# EAGLE design WiFiShield (EAGLE 6.5.0)
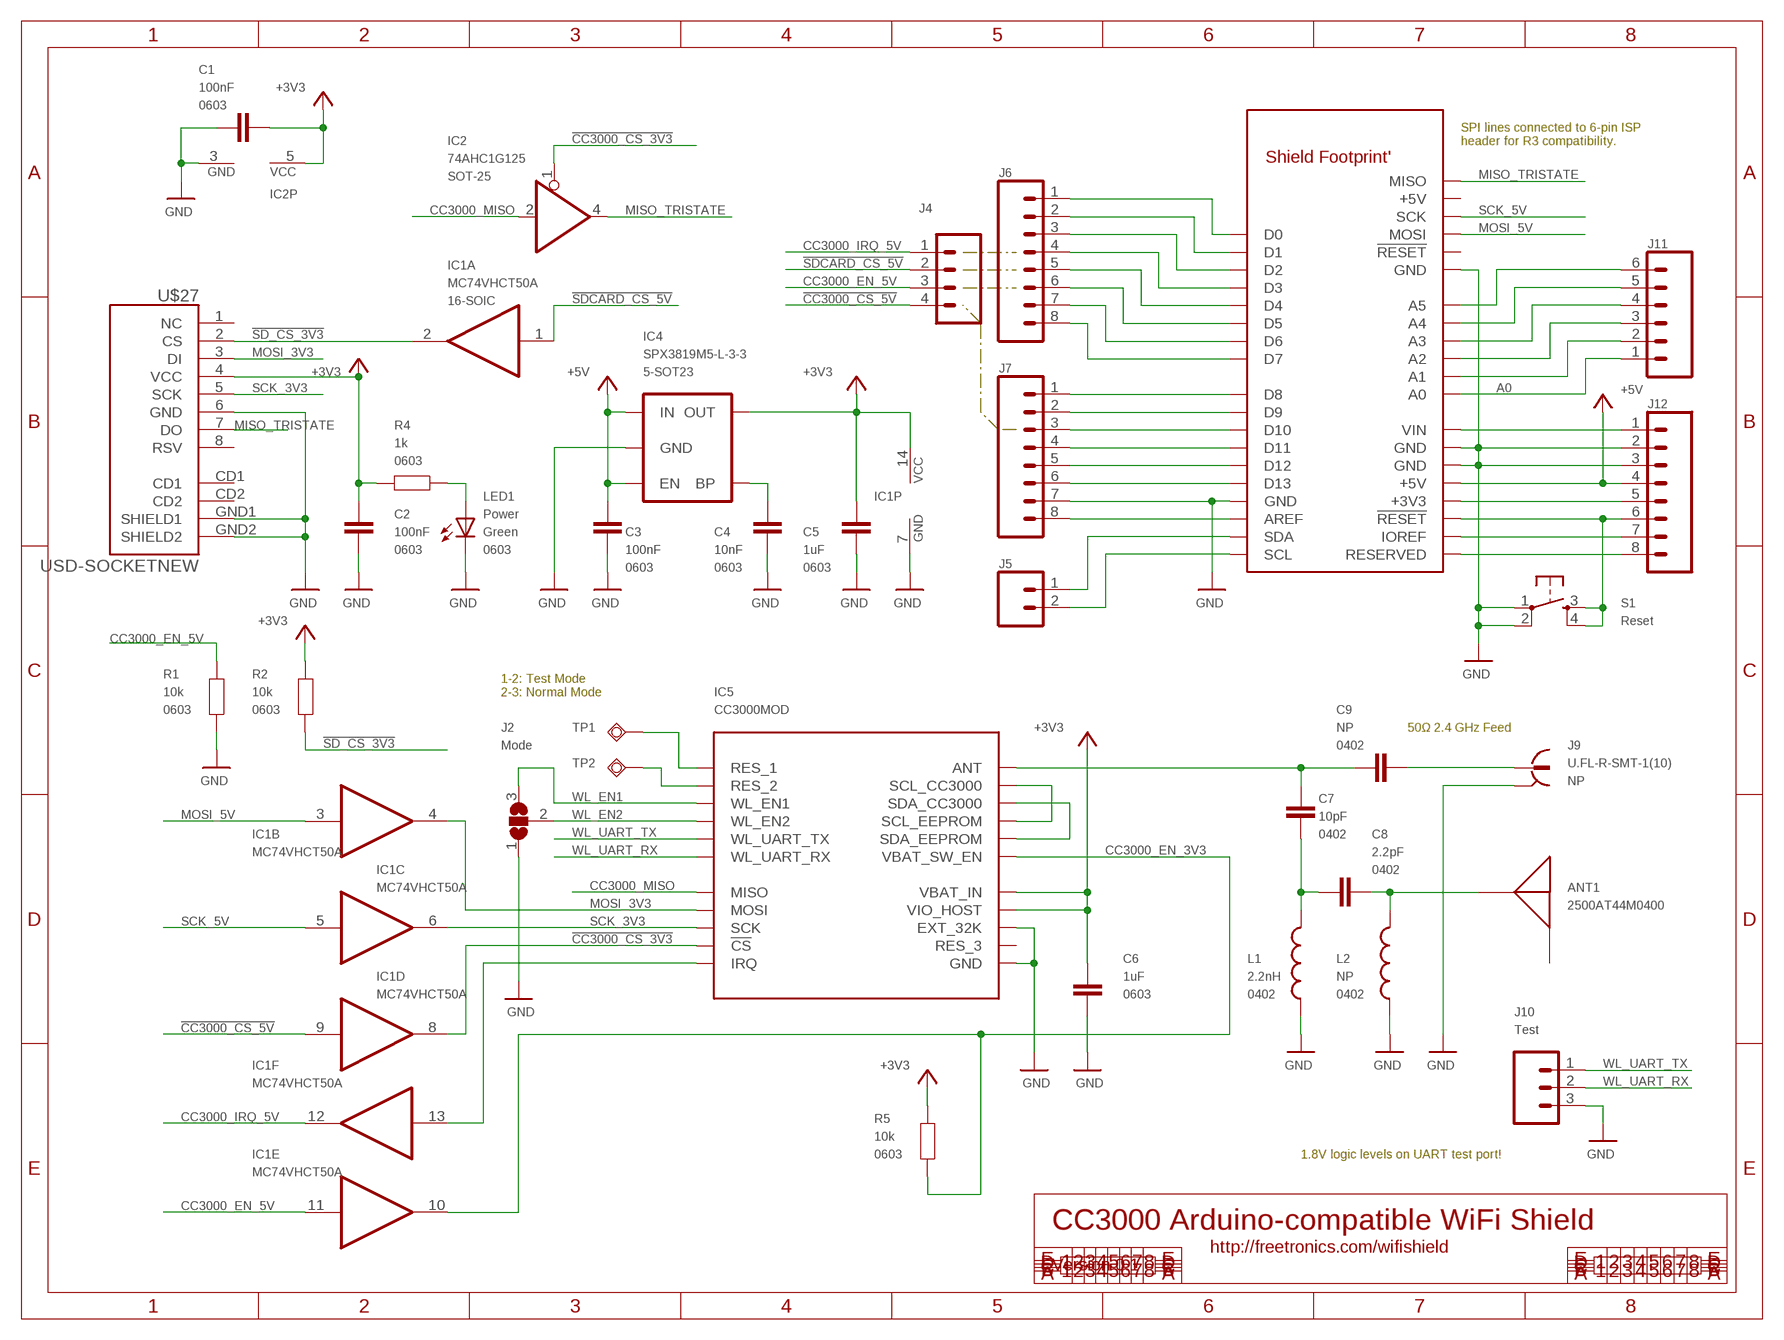
[diagram p0: schematic, sheet 1]

## Parts
ANT1  2500AT44M0400  [2500AT44M0400]
C1  100nF  CAP0603  [0603]
C2  100nF  CAP0603  [0603]
C3  100nF  CAP0603  [0603]
C4  10nF  CAP0603  [0603]
C5  1uF  CAP0603  [0603]
C6  1uF  CAP0603  [0603]
C7  10pF  CAP0402  [C0402]
C8  2.2pF  CAP0402  [C0402]
C9  NP  CAP0402  [C0402]
IC1  MC74VHCT50A  [SO14]
IC2  74AHC1G125  74AHC1G125DBV  [SOT23-5]
IC4  SPX3819M5-L-3-3  V_REG_LDOSMD  [SOT23-5]
IC5  CC3000MOD  CC3000  [CC3000]
J2  Mode  SJ2W  [SJ_2]
J4  M04PTH  [1X04]
J5  M02PTH  [1X02]
J6  M08STD  [1X08]
J7  M08STD  [1X08]
J8  ARDUINO-SHIELD_R3  [ARDUINO-SHIELD_R3_NOHOLES]
J9  U.FL-R-SMT-1(10)  UFL  [UFL]
J10  Test  M03PTH  [1X03]
J11  M06SIP  [1X06]
J12  M08STD  [1X08]
L1  2.2nH  INDUCTOR0402  [C0402]
L2  NP  INDUCTOR0402  [C0402]
LED1  Power  LED0603  [LED-0603]
R1  10k  RESISTOR0603  [0603]
R2  10k  RESISTOR0603  [0603]
R4  1k  RESISTOR0603  [0603]
R5  10k  RESISTOR0603  [0603]
S1  Reset  TAC_SWITCHSMD  [TACTILE_SWITCH_SMD]
TP1  R1  TPSQTP06R  [TP06R]
TP2  R2  TPSQTP06R  [TP06R]
U$27  USD-SOCKETNEW  [MICRO-SD-SOCKET-PP]

## Nets
!CC3000_CS_3V3: IC1.8(D:O) IC2.1(OE) IC5.12(!CS)
!CC3000_CS_5V: IC1.9(D:I) J4.4
!SD_CS_3V3: IC1.2(A:O) R2.2 U$27.2(CS)
!SDCARD_CS_5V: IC1.1(A:I) J4.2
+3V3: C1.2 C2.1 C5.1 C6.2 IC1.14(P:VCC) IC2.5(VCC) IC4.5(OUT) IC5.19(VBAT_IN) IC5.23(VIO_HOST) R2.1 R4.2 R5.1 U$27.4(VCC)
+5V: C3.2 IC4.1(IN) IC4.3(EN) J8.+5V J12.4
A0: J8.A0 J11.1
CC3000_EN_3V3: IC1.10(E:O) IC5.26(VBAT_SW_EN) R5.2
CC3000_EN_5V: IC1.11(E:I) J4.3 R1.1
CC3000_IRQ_5V: IC1.12(F:O) J4.1
CC3000_MISO: IC2.2(I) IC5.13(MISO)
GND: C1.1 C2.2 C3.1 C4.1 C5.2 C6.1 IC1.7(P:GND) IC2.3(GND) IC4.2(GND) IC5.1(GND) IC5.9(GND) IC5.10(GND) IC5.11(GND) IC5.16(GND) IC5.18(GND) IC5.20(GND) IC5.21(EXT_32K) IC5.22(GND) IC5.25(GND) IC5.31(GND) IC5.32(GND) IC5.33(GND) IC5.34(GND) IC5.36(GND) IC5.37(GND) IC5.38(GND) IC5.39(GND) IC5.40(GND) IC5.41(GND) IC5.42(GND) IC5.43(GND) IC5.44(GND) IC5.45(GND) IC5.46(GND) J2.1 J7.7 J8.GND J8.GND@0(GND) J8.GND@1(GND) J8.GND@2(GND) J9.GND J9.GND@1(GND) J10.3 J12.2 J12.3 L1.2 L2.2 LED1.C R1.2 S1.1 S1.2 U$27.6(GND) U$27.GND1(SHIELD1) U$27.GND2(SHIELD2)
IOREF: J8.IOREF J12.7
MISO_TRISTATE: IC2.4(O) J8.MISO U$27.7(DO)
MOSI_3V3: IC1.4(B:O) IC5.15(MOSI) U$27.3(DI)
MOSI_5V: IC1.3(B:I) J8.MOSI
N$1: IC5.27(SDA_EEPROM) IC5.28(SDA_CC3000)
N$2: IC5.29(SCL_EEPROM) IC5.30(SCL_CC3000)
N$4: LED1.A R4.1
N$16: C7.2 C9.2 IC5.35(ANT)
N$28: IC5.4(RES_2) TP2.TP
N$29: IC5.2(RES_1) TP1.TP
N$30: C9.1 J9.SIG
N$42: IC1.13(F:I) IC5.14(IRQ)
N$43: C4.2 IC4.4(BP)
N$48: J8.A1 J11.2
N$49: J8.A2 J11.3
N$50: J8.A3 J11.4
N$72: J8.A4 J11.5
N$73: J8.A5 J11.6
N$74: J8.RESERVED J12.8
N$75: J8.VIN J12.1
N$77: J8.3V3(+3V3) J12.5
N$78: J8.!RESET J12.6 S1.3 S1.4
N$82: J6.1 J8.D0
N$87: J6.2 J8.D1
N$88: J6.3 J8.D2
N$89: J6.4 J8.D3
N$90: J6.5 J8.D4
N$103: C7.1 C8.2 L1.1
N$104: ANT1.P$1 C8.1 L2.1
N$123: J6.6 J8.D5
N$124: J6.7 J8.D6
N$125: J6.8 J8.D7
N$126: J5.1 J8.SDA
N$127: J7.8 J8.AREF
N$128: J7.6 J8.D13
N$129: J7.5 J8.D12
N$130: J5.2 J8.SCL
N$131: J7.1 J8.D8
N$132: J7.2 J8.D9
N$133: J7.3 J8.D10
N$134: J7.4 J8.D11
SCK_3V3: IC1.6(C:O) IC5.17(SCK) U$27.5(SCK)
SCK_5V: IC1.5(C:I) J8.SCK
WL_EN1: IC5.7(WL_EN1) J2.3
WL_EN2: IC5.5(WL_EN2) J2.2
WL_UART_RX: IC5.8(WL_UART_RX) J10.2
WL_UART_TX: IC5.6(WL_UART_TX) J10.1
Unconnected: ANT1.P$2 IC5.24(RES_3) J8.!RESET@0(!RESET) J8.+5V@0(+5V) U$27.1(NC) U$27.8(RSV) U$27.CD1 U$27.CD2

## Notes on the sheet
- SPI lines connected to 6-pin ISP
  header for R3 compatibility.
- 1-2: Test Mode
  2-3: Normal Mode
- 50Ω 2.4 GHz Feed
- 1.8V logic levels on UART test port!
- CC3000 Arduino-compatible WiFi Shield
- http://freetronics.com/wifishield
- Version 0.1

## Library data of the parts
ANT1 = freetronics-angus:2500AT44M0400
C1-C6 = freetronics-master-v1:CAP: Capacitor Standard 0603 ceramic capacitor, and 0.1" leaded capacitor.; PACKAGE: 0603
C7-C9 = freetronics-master-v1:CAP: Capacitor Standard 0603 ceramic capacitor, and 0.1" leaded capacitor.; PACKAGE: 0402
IC1 = freetronics-angus:MC74VHCT50A: Hex non-inverting BUFFER; PACKAGE: 16-SOIC
IC2 = 74xx-little-de:74*1G125: Single Bus Buffer Gate with 3-State Output; PACKAGE: SOT-25
IC4 = SparkFun:V_REG_LDO: Voltage Regulator LDO Standard 150mA LDO voltage regulator in SOT-23 layout. Micrel part MIC5205. BP (by-pass) pin is used to lower output noise with 470pF cap.; PACKAGE: 5-SOT23
IC5 = freetronics-luke:CC3000: Texas Instruments CC3000 802.11b/g Network Processor
J2 = freetronics-master-v1:SJ2W: SMD solder JUMPER
J4 = freetronics-master-v1.1:M04: Header 4 Standard 4-pin 0.1" header. Use with straight break away headers (SKU : PRT-00116), right angle break away headers (PRT-00553), swiss pins (PRT-00743), machine pins (PRT-00117), and female headers (PRT-00115). Molex polarized connector foot print use with SKU : PRT-08231 with associated crimp pins and housings.
J5 = freetronics-master-v1:M02: Header 2 Standard 2-pin 0.1" header. Use with straight break away headers (SKU : PRT-00116), right angle break away headers (PRT-00553), swiss pins (PRT-00743), machine pins (PRT-00117), and female headers (PRT-00115). Molex polarized connector foot print use with SKU : PRT-08233 with associated crimp pins and housings.
J6 J7 J12 = freetronics-master-v1:M08: Header 8 Standard 8-pin 0.1" header. Use with straight break away headers (SKU : PRT-00116), right angle break away headers (PRT-00553), swiss pins (PRT-00743), machine pins (PRT-00117), and female headers (PRT-00115).
J8 = freetronics-angus:ARDUINO-SHIELD_R3: Arduino Uno/Eleven/Leonardo shield, R3 compatible.
J9 = freetronics-luke:UFL: U.FL RF connector; NOTE: NP
J10 = freetronics-master-v1:M03: Header 3 Standard 3-pin 0.1" header. Use with straight break away headers (SKU : PRT-00116), right angle break away headers (PRT-00553), swiss pins (PRT-00743), machine pins (PRT-00117), and female headers (PRT-00115). Molex polarized connector foot print use with SKU : PRT-08232 with associated crimp pins and housings.
J11 = freetronics-master-v1:M06: Header 6 Standard 6-pin 0.1" header. Use with straight break away headers (SKU : PRT-00116), right angle break away headers (PRT-00553), swiss pins (PRT-00743), machine pins (PRT-00117), and female headers (PRT-00115). Molex polarized connector foot print use with SKU : PRT-08094 with associated crimp pins and housings. NOTES ON THE VARIANTS LOCK and LOCK_LONGPADS... This footprint was designed to help hold the alignment of a through-hole component (i.e. 6-pin header) while soldering it into place. You may notice that each hole has been shifted either up or down by 0.005 of an inch from it's more standard position (which is a perfectly straight line). This slight alteration caused the pins (the squares in the middle) to touch the edges of the holes. Because they are alternating, it causes a "brace" to hold the component in place. 0.005 has proven to be the perfect amount of "off-center" position when using our standard breakaway headers. Although looks a little odd when you look at the bare footprint, once you have a header in there, the alteration is very hard to notice. Also, if you push a header all the way into place, it is covered up entirely on the bottom side. This idea of altering the position of holes to aid alignment will be further integrated into the Sparkfun Library for other footprints. It can help hold any component with 3 or more connection pins.
L1 L2 = freetronics-master-v1:INDUCTOR: Inductors Basic Inductor/Choke - 0603 and 1206. Footprints are not proven and vary greatly between part numbers.; PACKAGE: 0402
LED1 = freetronics-master-v1:LED: LEDs Standard schematic elements and footprints for 5mm, 3mm, 1206, and 0603 sized LEDs. 5mm - Spark Fun Electronics SKU : COM-00529 (and others); COLOUR: Green; PACKAGE: 0603
R1 R2 R4 R5 = freetronics-master-v1:RESISTOR: Resistor Basic schematic elements and footprints for 0603, 1206, and PTH 1/10th watt (small) resistors.; PACKAGE: 0603
S1 = freetronics:TAC_SWITCH: Momentary Switch Button commonly used for reset or general input. Spark Fun Electronics SKU : COM-00097
TP1 TP2 = testpad:TPSQ: Test pad
U$27 = freetronics-master-v1.1:USD-SOCKET: microSD Socket Push-push type uSD socket. Schematic element and footprint production proven. Spark Fun Electronics SKU : PRT-00127. tDoc lines correctly indicate media card edge positions when inserting (unlocked, locked, depressed).

## Net classes
1 POWER: width 0.305 mm

## Board
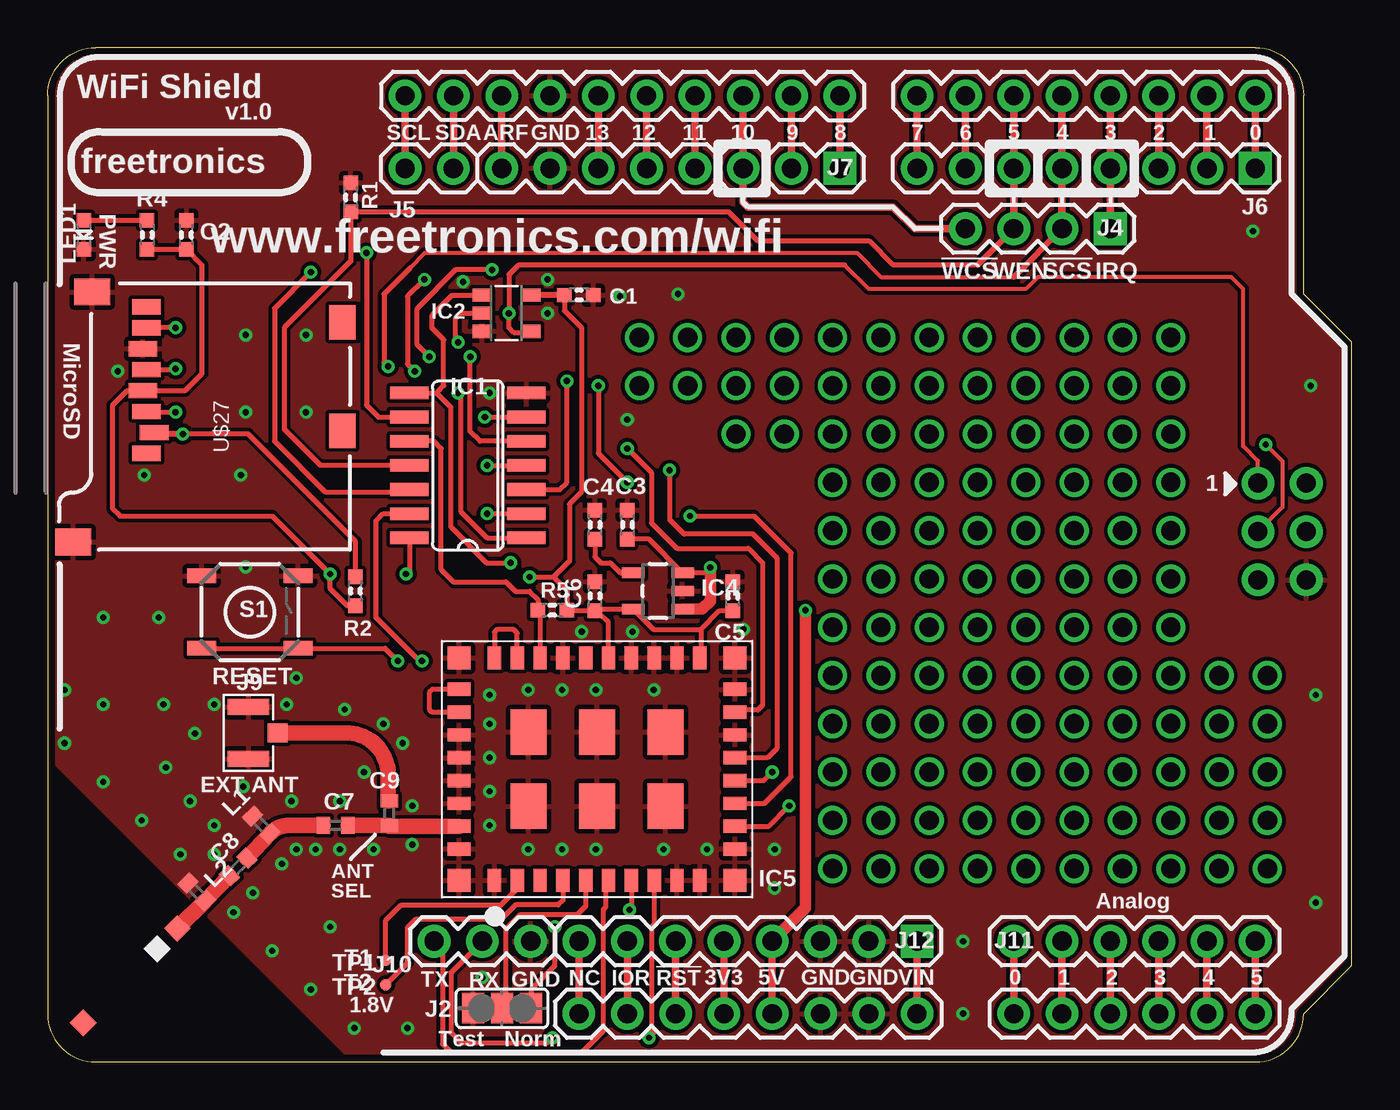
[diagram p1: board, top side]
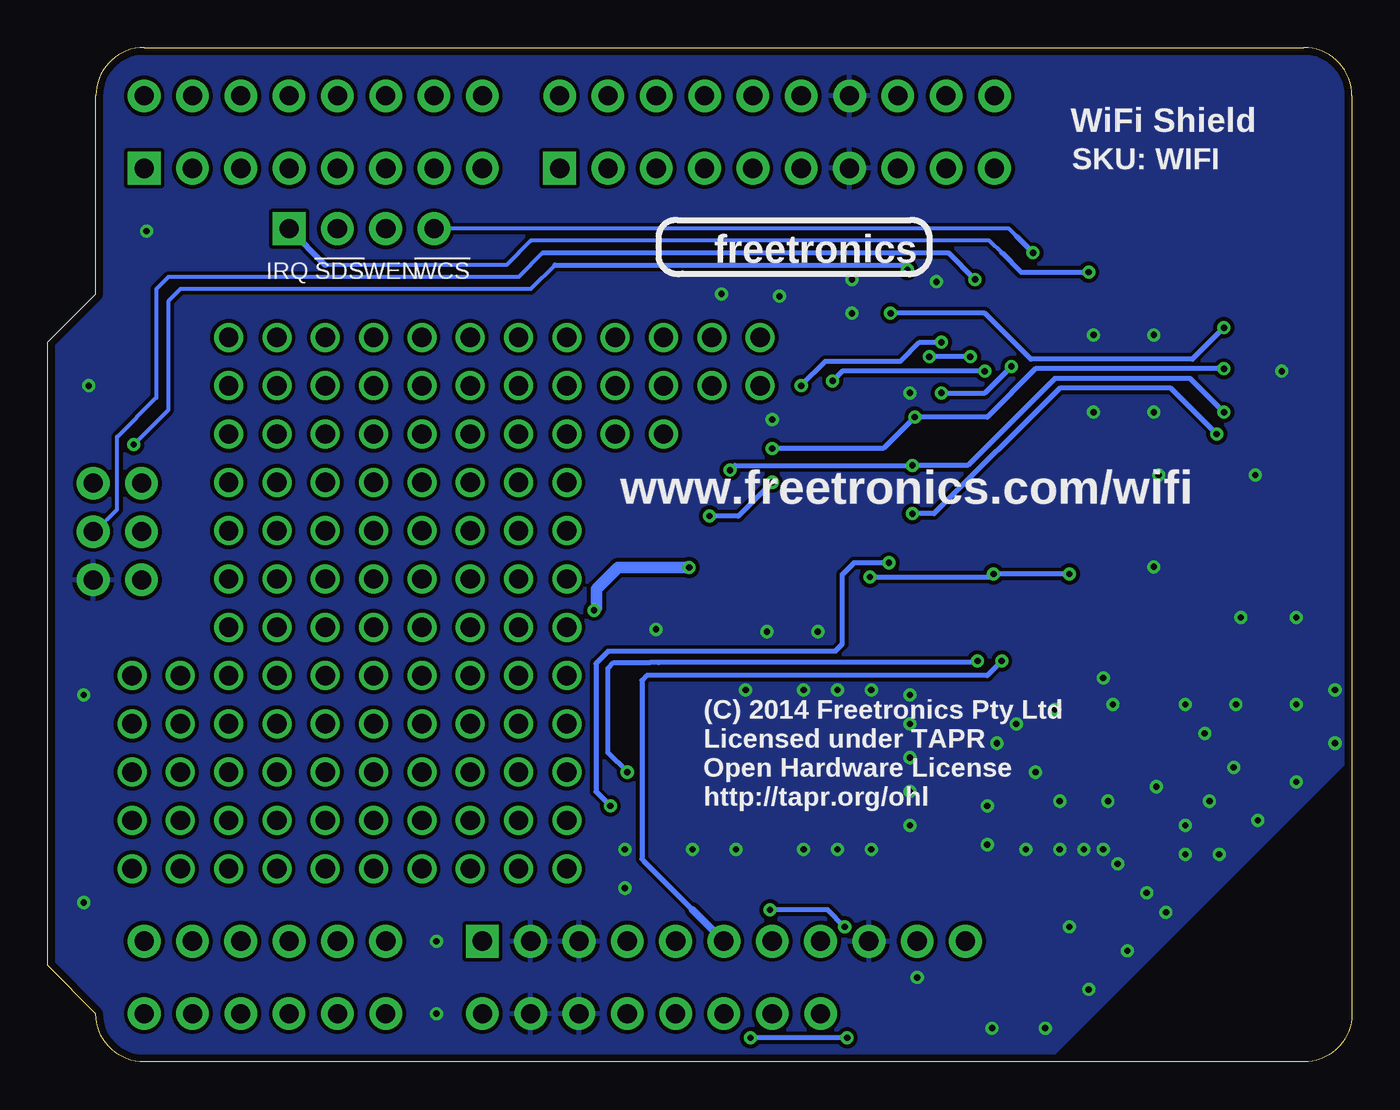
[diagram p2: board, bottom side, seen from below]

Size 68.58 x 53.34 mm. Coordinates in mm from the lower left corner, seen from the top.
Copper layers (1*16): Top 0.0356mm / dielectric 1.5011mm / Bottom 0.0356mm
Design rules "LaenPCBOrder *": minimum track width 6mil, minimum drill 13mil, track to track 6mil, track to pad 6mil, pad to pad 6mil, via to via 6mil, smd to smd 6mil, copper to edge 15mil, drill to drill 6mil, minimum pad ring 14mil, minimum via ring 7mil, stop-mask expansion 4mil, vias tented up to drill 14mil, thermal gap 10mil

### Footprints (pad centres in the part's own frame; a part is rotated, then mirrored left to right if it is on the bottom)
2500AT44M0400 = smd 1 x 1: P$1 -3.5,0; P$2 3.5,0
0603 = smd 0.762 x 0.762: 1 -0.762,0; 2 0.762,0
C0402 = smd 0.7 x 0.9: 1 -0.65,0; 2 0.65,0
SO14 = smd 0.66 x 2.032: 1 -3.81,-3.073; 2 -2.54,-3.073; 3 -1.27,-3.073; 4 0,-3.073; 5 1.27,-3.073; 6 2.54,-3.073; 7 3.81,-3.073; 8 3.81,3.073; 9 2.54,3.073; 10 1.27,3.073; 11 0,3.073; 12 -1.27,3.073; 13 -2.54,3.073; 14 -3.81,3.073
SOT23-5 = smd 0.69 x 0.99: 1 -0.95,-1.29; 2 0,-1.29; 3 0.95,-1.29; 4 0.95,1.3; 5 -0.95,1.3
SOT23-5' = smd 0.55 x 1.2: 1 -0.95,-1.3; 2 0,-1.3; 3 0.95,-1.3; 4 0.95,1.3; 5 -0.95,1.3
CC3000 = smd 1.2 x 0.7: 1 -5.85,5.4; 2 -5.85,4.2; 3 -5.85,3; 4 -5.85,1.8; 5 -5.85,0.6; 6 -5.85,-0.6; 7 -5.85,-1.8; 8 -5.85,-3; 9 -5.85,-4.2; 10 -5.85,-5.4; 19 5.85,-5.4; 20 5.85,-4.2; 21 5.85,-3; 22 5.85,-1.8; 23 5.85,-0.6; 24 5.85,0.6; 25 5.85,1.8; 26 5.85,3; 27 5.85,4.2; 28 5.85,5.4 | smd 0.7 x 1.2: 11 -4.2,-7.25; 12 -3,-7.25; 13 -1.8,-7.25; 14 -0.6,-7.25; 15 0.6,-7.25; 16 1.8,-7.25; 17 3,-7.25; 18 4.2,-7.25; 29 4.2,7.25; 30 3,7.25; 31 1.8,7.25; 32 0.6,7.25; 33 -0.6,7.25; 34 -1.8,7.25; 35 -3,7.25; 36 -4.2,7.25 | smd 2.4 x 1.9: 37 -1.95,3.6; 38 -1.95,0; 39 -1.95,-3.6; 40 1.95,3.6; 41 1.95,0; 42 1.95,-3.6 | smd 1.2 x 1.2: 43 -5.85,7.25; 44 -5.85,-7.25; 45 5.85,-7.25; 46 5.85,7.25
SJ_2 = smd 1.168 x 1.6: 1 -1.524,0; 2 0,0; 3 1.524,0
1X04 = drill 1.016 square: 1 0,0 | drill 1.016: 2 2.54,0; 3 5.08,0; 4 7.62,0
1X02 = drill 1.016: 1 0,0; 2 2.54,0
1X08 = drill 1.016 square: 1 0,0 | drill 1.016: 2 2.54,0; 3 5.08,0; 4 7.62,0; 5 10.16,0; 6 12.7,0; 7 15.24,0; 8 17.78,0
ARDUINO-SHIELD_R3_NOHOLES = drill 1 pad 1.676: 3V3 0,-24.13; !RESET -2.54,-24.13; !RESET@0 28.08,-1.32; +5V 2.54,-24.13; +5V@0 30.62,3.76; A0 15.24,-24.13; A1 17.78,-24.13; A2 20.32,-24.13; A3 22.86,-24.13; A4 25.4,-24.13; A5 27.94,-24.13; AREF -11.684,24.13; D0 27.94,24.13; D1 25.4,24.13; D2 22.86,24.13; D3 20.32,24.13; D4 17.78,24.13; D5 15.24,24.13; D6 12.7,24.13; D7 10.16,24.13; D8 6.096,24.13; D9 3.556,24.13; D10 1.016,24.13; D11 -1.524,24.13; D12 -4.064,24.13; D13 -6.604,24.13; GND 7.62,-24.13; GND@0 5.08,-24.13; GND@1 -9.144,24.13; GND@2 30.62,-1.32; IOREF -5.08,-24.13; MISO 28.08,3.76; MOSI 30.62,1.22; RESERVED -7.62,-24.13; SCK 28.08,1.22; SCL -16.764,24.13; SDA -14.224,24.13; VIN 10.16,-24.13
UFL = smd 2.2 x 0.85: GND 0,1.375; GND@1 0,-1.375 | smd 1.05 x 1: SIG -1.525,0
1X03 = drill 1.016: 1 0,0; 2 2.54,0; 3 5.08,0
1X06 = drill 1.016: 1 0,0; 2 2.54,0; 3 5.08,0; 4 7.62,0; 5 10.16,0; 6 12.7,0
LED-0603 = smd 0.762 x 0.762: A -0.762,0; C 0.762,0
TACTILE_SWITCH_SMD = smd 1.524 x 0.762: 1 -2.54,1.905; 2 2.54,1.905; 3 -2.54,-1.905; 4 2.54,-1.905
TP06R = smd 0.6 x 0.6: TP 0,0
MICRO-SD-SOCKET-PP = smd 0.8 x 1.5: 1 -8.94,10.7; 2 -7.84,10.3; 3 -6.74,10.7; 4 -5.64,10.9; 5 -4.54,10.7; 6 -3.44,10.9; 7 -2.34,10.7; 8 -1.24,10.7 | smd 1.8 x 1.4: CD1 -2.05,0.4; CD2 -7.75,0.4 | smd 1.4 x 1.9: GND1 -0.45,13.55; GND2 -13.6,14.55

### Placement (x,y rotation side)
ANT1  4.35,4.54 225 top
C1  27.94,40.32 180 top
C2  7.3,43.5 90 top
C3  30.49,28.25 270 top
C4  28.78,28.25 270 top
C5  36.03,24.5 90 top
C6  28.78,24.5 270 top
C7  15.14,12.45 0 top
C8  10.02,10.25 45 top
C9  17.97,13.08 270 top
IC1  22.1,31.37 90 top
IC2  24.13,39.37 270 top
IC4  SPX3819M5-L-3-3  [SOT23-5']  32.09,24.77 90 top
IC5  28.89,15.4 90 top
J2  23.89,2.83 0 top
J4  55.88,43.81 180 top
J5  21.34,46.99 180 top
J6  63.5,46.99 180 top
J7  41.66,46.99 180 top
J8  35.56,26.67 0 top
J9  10.56,17.3 180 top
J10  20.32,6.35 0 top
J11  50.8,6.35 0 top
J12  45.72,6.35 180 top
L1  11.24,12.47 135 top
L2  7.84,8.94 135 top
LED1  1.91,43.5 270 top
R1  15.94,45.47 90 top
R2  16.19,24.77 90 top
R4  5.24,43.5 270 top
R5  26.54,23.75 180 top
S1  10.64,23.65 0 top
TP1  17.78,5.33 0 top
TP2  17.78,4.06 0 top
U$27  15.91,40.94 90 top

### Tracks (layer width: path | path; a pad name or v marks a point on that pad's centre or on a via)
!CC3000_CS_3V3  (via drill 0.33)
  Top 0.254: 20.45,35.18 21.21,34.42 21.21,28.14 23.09,26.25 v24.34,26.25 | IC1.8 20.45,35.18 | 20.45,35.18 20.83,35.56 20.83,37.97 20.19,38.61 20.19,39.24 21.27,40.32 IC2.1 | IC5.12 37.93,12.4 v38.99,13.46
  Bottom 0.254: v24.34,26.25 26.18,26.25 26.8,25.64 26.8,21.97 27.18,21.59 39.12,21.59 39.75,20.95 39.75,14.22 v38.99,13.46
!CC3000_CS_5V  (via drill 0.33)
  Top 0.254: IC1.9 17.4,33.91 16.76,34.54 v16.76,42.55
  Bottom 0.203: 17.65,43.43 18.03,43.81 J4.4
  Bottom 0.254: 17.65,43.43 v16.76,42.55
!SD_CS_3V3  (via drill 0.33)
  Top 0.254: v23.11,28.83 IC1.2 | 6.73,33.02 v7.11,33.02 10.54,33.02 16.19,27.37 R2.2
  Top 0.305: 6.73,33.02 5.69,33.02 U$27.2
  Bottom 0.254: v7.11,33.02 9.53,35.43 15.37,35.43 21.97,28.83 v23.11,28.83
!SDCARD_CS_5V  (via drill 0.33)
  Top 0.203: 19.05,41.75 19.84,42.55 42.55,42.55 43.81,41.27 50.8,41.27
  Top 0.254: v21.59,35.18 21.72,35.05 21.72,28.96 23.11,27.56 IC1.1 | 19.05,41.75 17.68,40.39 17.68,36.8 v17.91,36.58
  Top 0.305: 50.8,41.27 J4.2
  Top 0.406: 53.34,46.83 J4.2
  Bottom 0.254: v21.59,35.18 19.3,35.18 v17.91,36.58
+3V3  (via drill 0.33)
  Top 0.203: IC2.5
  Top 0.254: R4.2 C2.1 8.13,41.91 8.13,36.2 7.24,35.3 U$27.4 4.19,35.3 3.43,34.54 3.43,29.08 3.81,28.7 11.81,28.7 v14.86,25.65 14.86,24.89 15.75,24 R2.1 | 34.34,22.75 34.34,21.3 IC5.19 | C6.2 28.81,23.82 IC4.5 31.86,22.75 34.34,22.75 | IC5.23 29.49,23.13 C6.2 | 28.62,24 C6.2 | IC1.14 19.02,25.83 v18.84,25.65 | v25.34,25.5 26.59,25.5 | C6.2 R5.1 27.3,24.79 26.59,25.5 | 34.34,22.75 35.33,23.74 C5.1 | IC2.5 27.11,40.32 27.18,40.39 27.18,39.5 28.07,38.61 28.07,29.97 27.43,29.34 27.43,26.34 26.59,25.5
  Top 0.305: C1.2 IC2.5
  Bottom 0.254: v14.86,25.65 v18.84,25.65 19,25.5 v25.34,25.5
+5V  (via drill 0.33)
  Top 0.254: v34.84,26 34.56,25.71 IC4.3 31.62,27.49 C3.2
  Top 0.406: J12.4 J8.+5V
  Top 0.61: v39.84,23.75 39.84,8.1 J12.4 | IC4.1 34.41,23.82 34.84,24.25 v34.84,26
  Bottom 0.254: 39.72,23.88 v39.84,23.75
  Bottom 0.61: 39.72,23.88 39.72,24.88 38.59,26 v34.84,26
A0
  Top 0.406: J11.1 J8.A0
CC3000_EN_3V3
  Top 0.254: 26.09,21.45 IC5.26 25.89,23.64 R5.2 25.78,24.31 25.34,24.75 24.59,24.75 24.09,25.25 21.34,25.25 20.7,25.89 20.7,32.26 20.32,32.64 IC1.10
CC3000_EN_5V
  Top 0.254: IC1.11 14.35,31.37 12.45,33.27 12.45,38.61 15.94,42.1 R1.1 35.81,44.7 37.34,43.18 43.18,43.18 44.45,41.91 48.9,41.91
  Top 0.305: J4.3 48.9,41.91
  Top 0.406: 50.8,46.83 J4.3
CC3000_IRQ_5V  (via drill 0.33)
  Top 0.254: IC1.12 18.9,29.97 14.61,29.97 11.94,32.64 11.94,39.62 v13.84,41.53
  Top 0.406: 55.88,46.83 J4.1
  Bottom 0.203: 53.98,41.91 44.45,41.91 43.18,43.18 19.05,43.18 18.41,42.55
  Bottom 0.254: 18.41,42.55 17.4,41.53 v13.84,41.53
  Bottom 0.305: 53.98,41.91 J4.1
CC3000_MISO  (via drill 0.33)
  Top 0.254: v21.59,37.85 21.46,37.97 21.46,39.12 21.72,39.37 IC2.2 | v28.96,35.56 28.96,32 v30.48,30.48 | v33.78,28.7 37.14,28.7 39.09,26.75 39.09,15 37.69,13.6 IC5.13
  Bottom 0.254: v21.59,37.85 22.73,37.85 23.75,36.83 27.69,36.83 v28.96,35.56 | v30.48,30.48 32.26,28.7 v33.78,28.7
GND  (via drill 0.33)
  other vias: 30.1,40.26 23.24,35.18 30.48,33.78 10.41,34.16 10.41,38.23 13.59,38.23 13.59,34.16 21.84,41.02 10.41,26.04 3.68,36.32 36.59,22.75 7.75,17.27 17.65,17.78 18.67,16.76 16.64,15.24 6.22,15.49 2.92,18.8 2.92,23.37 23.24,19.3 23.24,17.78 23.24,16 23.24,14.22 23.24,12.45 25.27,11.18 27.05,11.18 28.83,11.18 32.38,11.18 34.67,11.18 31.88,19.56 28.83,19.56 27.05,19.56 25.27,19.56 19.18,13.46 19.18,11.43 15.37,13.72 12.83,13.72 10.29,14.48 8.76,12.45 8.76,10.92 6.99,10.92 9.78,7.87 10.79,8.89 12.32,10.41 13.08,11.18 14.1,11.18 15.37,11.18 17.14,11.18 4.95,12.7 2.92,14.73 0.89,16.76 11.81,5.84 13.84,3.81 16.13,1.78 18.92,1.78 14.86,7.11 7.49,13.72 0.89,19.56 10.16,30.86 5.08,30.86 22.86,4.45 38.23,11.18 38.23,9.14 48.13,6.35 48.13,2.54 66.67,8.38 66.67,19.3 66.42,35.56 63.37,43.69 33.15,40.39 26.29,39.37 26.29,41.15 15.62,18.54 13.08,20.19 6.1,18.8 5.84,23.37 8.76,18.8 12.57,18.8 30.75,22.62 28.09,22.62
  pour Bottom (isolate 0.203): 16.89,-0.76 68.71,-0.76 68.71,54.1 -0.64,54.1 -0.64,16.76
  pour Top (isolate 0.203, rank 2): 16.89,-0.76 68.71,-0.76 68.71,54.1 -0.64,54.1 -0.64,16.76
  pour Top (isolate 0.254, rank 3, no thermals): 5.33,10.79 9.27,6.86 11.18,6.86 15.49,11.18 18.54,11.18 18.92,11.56 18.92,14.48 18.54,14.86 9.65,14.86
IOREF
  Top 0.406: J12.7 J8.IOREF
MISO_TRISTATE  (via drill 0.33)
  Top 0.203: J8.MISO 63.64,31.61 62.87,32.38 62.87,40.64 62.23,41.27 52.07,41.27 51.44,40.64 43.18,40.64 41.91,41.91
  Top 0.254: U$27.7 4.7,38.6 4.71,38.61 v6.73,38.61 | 41.91,41.91 24.77,41.91 24.26,41.4 v24.26,39.37 24.26,38.61 24.51,38.35 25.36,38.35 IC2.4
  Bottom 0.254: v6.73,38.61 8.38,36.96 16.89,36.96 19.3,39.37 v24.26,39.37
MOSI_3V3  (via drill 0.33)
  Top 0.254: v32.7,31.11 32.7,28.51 33.46,27.75 37.09,27.75 38.34,26.5 38.34,16.5 37.84,16 IC5.15 | v23.11,31.37 IC1.4 | U$27.3 5.25,34.16 v6.73,34.16
  Bottom 0.254: v32.7,31.11 32.45,31.37 v23.11,31.37 20.19,31.37 15.62,35.94 8.51,35.94 v6.73,34.16
MOSI_5V  (via drill 0.33)
  Top 0.254: IC1.3 26.92,30.1 27.3,30.48 v27.3,35.81 | v19.81,41.15 18.92,40.26 18.92,36.7 v19.3,36.32
  Bottom 0.203: 66.04,27.94 64.93,29.05 64.93,32.86 62.87,34.92 62.87,40.64 62.23,41.27 43.81,41.27 42.55,42.55
  Bottom 0.254: 66.04,27.94 66.13,27.94 J8.MOSI | 27.05,36.07 v27.3,35.81 26.8,36.32 v19.3,36.32 | 42.55,42.55 21.21,42.55 v19.81,41.15
N$1
  Top 0.254: IC5.27 24.69,22.55 24.51,22.73 23.62,22.73 23.5,22.61 IC5.28
N$2
  Top 0.254: IC5.29 20.23,19.6 20.07,19.43 20.07,18.54 20.19,18.41 21.63,18.41 IC5.30
N$4
  Top 0.254: LED1.A R4.1
N$6  (via drill 1.02)
  other vias: 61.59,15.24
N$7  (via drill 1.02)
  other vias: 61.59,17.78
N$8  (via drill 1.02)
  other vias: 61.59,20.32
N$9  (via drill 1.02)
  other vias: 64.14,20.32
N$10  (via drill 1.02)
  other vias: 61.59,10.16
N$11  (via drill 1.02)
  other vias: 64.14,17.78
N$12  (via drill 1.02)
  other vias: 61.59,12.7
N$14  (via drill 1.02)
  other vias: 64.14,15.24
N$16
  Top 0.813: IC5.35 17.97,12.4 C9.2 17.97,12.45 C7.2
N$17  (via drill 1.02)
  other vias: 31.11,35.56
N$18  (via drill 1.02)
  other vias: 31.11,38.1
N$19  (via drill 1.02)
  other vias: 59.05,22.86
N$20  (via drill 1.02)
  other vias: 36.2,33.02
N$21  (via drill 1.02)
  other vias: 64.14,12.7
N$23  (via drill 1.02)
  other vias: 64.14,10.16
N$24  (via drill 1.02)
  other vias: 59.05,38.1
N$25  (via drill 1.02)
  other vias: 59.05,35.56
N$26  (via drill 1.02)
  other vias: 59.05,33.02
N$27  (via drill 1.02)
  other vias: 59.05,30.48
N$28
  Top 0.254: IC5.4 27.09,8.5 26.84,8.25 24.59,8.25 23.84,7.5 19.34,7.5 18.92,7.08 18.92,5.21 TP2.TP
N$29
  Top 0.254: IC5.2 24.69,9.1 23.84,8.25 18.59,8.25 17.78,7.43 TP1.TP
N$30
  Top 0.813: J9.SIG 15.85,17.3 arc-90 17.91,14.99 17.91,13.73 C9.1
N$31  (via drill 1.02)
  other vias: 59.05,27.94
N$32  (via drill 1.02)
  other vias: 59.05,25.4
N$33  (via drill 1.02)
  other vias: 59.05,20.32
N$34  (via drill 1.02)
  other vias: 59.05,17.78
N$35
  Top 0.203: 23.88,2.79 25.4,2.79
N$36  (via drill 1.02)
  other vias: 59.05,15.24
N$37  (via drill 1.02)
  other vias: 59.05,12.7
N$38  (via drill 1.02)
  other vias: 59.05,10.16
N$42  (via drill 0.33)
  Top 0.254: IC1.13 17.65,28.83 17.27,28.45 17.27,23.37 19.56,21.08 v19.68,21.08 | IC5.14 37.66,14.8 v38.1,15.24
  Bottom 0.254: v19.68,21.08 19.77,21 36.45,21 36.91,21 38.82,21 39.12,20.7 39.12,16.26 v38.1,15.24
N$43
  Top 0.254: C4.2 28.78,26.56 29.09,26.25 29.59,26.25 30.13,25.71 IC4.4
N$48
  Top 0.406: J11.2 J8.A1
N$49
  Top 0.406: J11.3 J8.A2
N$50
  Top 0.406: J11.4 J8.A3
N$59  (via drill 1.02)
  other vias: 33.66,35.56
N$63  (via drill 1.02)
  other vias: 33.66,38.1
N$64  (via drill 1.02)
  other vias: 36.2,35.56
N$65  (via drill 1.02)
  other vias: 36.2,38.1
N$67  (via drill 1.02)
  other vias: 38.73,33.02
N$69  (via drill 1.02)
  other vias: 41.27,10.16
N$70  (via drill 1.02)
  other vias: 43.81,10.16
N$72
  Top 0.406: J11.5 J8.A4
N$73
  Top 0.406: J11.6 J8.A5
N$74
  Top 0.406: J12.8 J8.RESERVED
N$75
  Top 0.406: J12.1 J8.VIN
N$76  (via drill 1.02)
  other vias: 38.73,38.1
N$77
  Top 0.406: J12.5 J8.3V3
N$78  (via drill 0.33)
  Top 0.254: S1.3 S1.4 17.75,21.75 v18.41,21.08
  Top 0.406: J12.6 J8.!RESET
  Bottom 0.254: v18.41,21.08 19.18,20.32 37.08,20.32 37.34,20.07 37.34,10.67 37.21,10.54 36.83,10.16 34.67,8
  Bottom 0.406: J12.6 34.67,8
N$79  (via drill 1.02)
  other vias: 43.81,38.1
N$80  (via drill 1.02)
  other vias: 46.35,38.1
N$82
  Top 0.406: J8.D0 J6.1
N$83  (via drill 1.02)
  other vias: 41.27,38.1
N$84  (via drill 1.02)
  other vias: 38.73,35.56
N$85  (via drill 1.02)
  other vias: 56.52,38.1
N$86  (via drill 1.02)
  other vias: 53.98,38.1
N$87
  Top 0.406: J8.D1 J6.2
N$88
  Top 0.406: J8.D2 J6.3
N$89
  Top 0.406: J8.D3 J6.4
N$90
  Top 0.406: J8.D4 J6.5
N$91  (via drill 1.02)
  other vias: 51.44,38.1
N$92  (via drill 1.02)
  other vias: 48.9,38.1
N$93  (via drill 1.02)
  other vias: 41.27,35.56
N$94  (via drill 1.02)
  other vias: 56.52,35.56
N$95  (via drill 1.02)
  other vias: 56.52,33.02
N$96  (via drill 1.02)
  other vias: 53.98,35.56
N$97  (via drill 1.02)
  other vias: 48.9,10.16
N$98  (via drill 1.02)
  other vias: 46.35,10.16
N$99  (via drill 1.02)
  other vias: 46.35,12.7
N$100  (via drill 1.02)
  other vias: 51.44,10.16
N$101  (via drill 1.02)
  other vias: 53.98,10.16
N$102  (via drill 1.02)
  other vias: 56.52,10.16
N$103
  Top 0.813: C8.2 L1.1 arc-47 12.7,12.45 C7.1
N$104
  Top 0.813: ANT1.P$1 L2.1 C8.1
N$105  (via drill 1.02)
  other vias: 56.52,12.7
N$108  (via drill 1.02)
  other vias: 56.52,15.24
N$109  (via drill 1.02)
  other vias: 53.98,15.24
N$110  (via drill 1.02)
  other vias: 46.35,35.56
N$114  (via drill 1.02)
  other vias: 43.81,35.56
N$116  (via drill 1.02)
  other vias: 41.27,33.02
N$117  (via drill 1.02)
  other vias: 41.27,30.48
N$118  (via drill 1.02)
  other vias: 51.44,35.56
N$119  (via drill 1.02)
  other vias: 56.52,30.48
N$120  (via drill 1.02)
  other vias: 53.98,33.02
N$121  (via drill 1.02)
  other vias: 48.9,35.56
N$123
  Top 0.406: J8.D5 J6.6
N$124
  Top 0.406: J8.D6 J6.7
N$125
  Top 0.406: J8.D7 J6.8
N$126
  Top 0.406: J8.SDA J5.1
N$127
  Top 0.406: J8.AREF J7.8
N$128
  Top 0.406: J8.D13 J7.6
N$129
  Top 0.406: J8.D12 J7.5
N$130
  Top 0.406: J8.SCL J5.2
N$131
  Top 0.406: J8.D8 J7.1
N$132
  Top 0.406: J8.D9 J7.2
N$133
  Top 0.406: J8.D10 J7.3 36.58,45.21 36.83,44.96 44.45,44.96 45.59,43.81 48.39,43.81
N$134
  Top 0.406: J8.D11 J7.4
N$135  (via drill 1.02)
  other vias: 56.52,27.94
N$136  (via drill 1.02)
  other vias: 41.27,27.94
N$137  (via drill 1.02)
  other vias: 41.27,12.7
N$138  (via drill 1.02)
  other vias: 41.27,15.24
N$139  (via drill 1.02)
  other vias: 41.27,17.78
N$140  (via drill 1.02)
  other vias: 43.81,12.7
N$141  (via drill 1.02)
  other vias: 48.9,12.7
N$142  (via drill 1.02)
  other vias: 51.44,12.7
N$143  (via drill 1.02)
  other vias: 53.98,12.7
N$145  (via drill 1.02)
  other vias: 56.52,17.78
N$146  (via drill 1.02)
  other vias: 56.52,20.32
N$147  (via drill 1.02)
  other vias: 51.44,15.24
N$148  (via drill 1.02)
  other vias: 53.98,17.78
N$149  (via drill 1.02)
  other vias: 56.52,25.4
N$150  (via drill 1.02)
  other vias: 53.98,25.4
N$151  (via drill 1.02)
  other vias: 56.52,22.86
N$152  (via drill 1.02)
  other vias: 53.98,22.86
N$153  (via drill 1.02)
  other vias: 53.98,27.94
N$154  (via drill 1.02)
  other vias: 53.98,30.48
N$155  (via drill 1.02)
  other vias: 51.44,33.02
N$156  (via drill 1.02)
  other vias: 48.9,33.02
N$157  (via drill 1.02)
  other vias: 46.35,33.02
N$158  (via drill 1.02)
  other vias: 41.27,25.4
N$159  (via drill 1.02)
  other vias: 43.81,33.02
N$160  (via drill 1.02)
  other vias: 41.27,22.86
N$161  (via drill 1.02)
  other vias: 41.27,20.32
N$162  (via drill 1.02)
  other vias: 43.81,15.24
N$163  (via drill 1.02)
  other vias: 46.35,15.24
N$164  (via drill 1.02)
  other vias: 48.9,15.24
N$165  (via drill 1.02)
  other vias: 53.98,20.32
N$166  (via drill 1.02)
  other vias: 43.81,30.48
N$173  (via drill 1.02)
  other vias: 46.35,30.48
N$174  (via drill 1.02)
  other vias: 48.9,30.48
N$175  (via drill 1.02)
  other vias: 51.44,30.48
N$176  (via drill 1.02)
  other vias: 51.44,27.94
N$182  (via drill 1.02)
  other vias: 51.44,25.4
N$183  (via drill 1.02)
  other vias: 48.9,22.86
N$186  (via drill 1.02)
  other vias: 51.44,22.86
N$187  (via drill 1.02)
  other vias: 51.44,20.32
N$188  (via drill 1.02)
  other vias: 51.44,17.78
N$189  (via drill 1.02)
  other vias: 43.81,17.78
N$190  (via drill 1.02)
  other vias: 43.81,20.32
N$191  (via drill 1.02)
  other vias: 43.81,22.86
N$192  (via drill 1.02)
  other vias: 43.81,25.4
N$193  (via drill 1.02)
  other vias: 43.81,27.94
N$194  (via drill 1.02)
  other vias: 46.35,27.94
N$195  (via drill 1.02)
  other vias: 48.9,27.94
N$196  (via drill 1.02)
  other vias: 46.35,25.4
N$197  (via drill 1.02)
  other vias: 48.9,25.4
N$199  (via drill 1.02)
  other vias: 48.9,20.32
N$200  (via drill 1.02)
  other vias: 48.9,17.78
N$201  (via drill 1.02)
  other vias: 46.35,17.78
N$202  (via drill 1.02)
  other vias: 46.35,20.32
N$203  (via drill 1.02)
  other vias: 46.35,22.86
SCK_3V3  (via drill 0.33)
  Top 0.254: v22.99,33.91 IC1.6 | U$27.5 6.68,36.4 v6.73,36.45 | v30.48,32.26 31.75,30.99 31.75,28.34 33.09,27 36.84,27 37.59,26.25 37.59,18.75 37.34,18.5 36.24,18.5 IC5.17
  Bottom 0.254: v6.73,36.45 16.64,36.45 19.18,33.91 v22.99,33.91 24.64,32.26 v30.48,32.26
SCK_5V  (via drill 0.33)
  Top 0.203: v64.06,32.46 64.93,31.59 64.93,29.18 J8.SCK
  Top 0.254: IC1.5 22.73,32.64 22.23,33.15 v22.23,37.08 | v23.37,41.66 21.46,41.66 19.43,39.62 19.43,37.72 v20.07,37.08
  Bottom 0.203: 41.91,41.91 43.18,40.64 61.59,40.64 62.23,40.01 62.23,34.29 v64.06,32.46
  Bottom 0.254: 22.23,37.21 v22.23,37.08 v20.07,37.08 | 41.91,41.91 23.62,41.91 v23.37,41.66
WL_EN1  (via drill 0.33)
  Top 0.254: IC5.7 30.69,8.1 v30.59,8 | J2.3 25.42,3.82 26.67,5.08 v26.67,7.11
  Bottom 0.254: v26.67,7.11 27.56,8 v30.59,8
WL_EN2
  Top 0.254: IC5.5 28.29,8.2 27.84,7.75 24.84,7.75 24.09,7 24.09,3.03 J2.2
WL_UART_RX  (via drill 0.33)
  Top 0.254: 31.84,9.5 IC5.8 31.89,7.25 31.75,7.11 31.75,1.4 v31.62,1.27 31.89,1.54 | J10.2 21.21,4.7 21.21,1.52 21.72,1.02 26.29,1.02 v26.54,1.27
  Bottom 0.254: v26.54,1.27 v31.62,1.27
WL_UART_TX
  Top 0.254: IC5.6 29.34,9.4 29.34,8.14 29.21,8 29.21,1.61 28.1,0.51 21.21,0.51 20.76,0.96 20.76,5.91 J10.1

### Text on the board
tPlace: WiFi Shield | v1.0 | freetronics | PWR | www.freetronics.com/wifi | !WCS | WEN | !SCS | IRQ | MicroSD | 1 | RESET | EXT ANT | ANT | SEL | Analog | T1 | T2 | TX | RX | GND | 1.8V | Test | Norm
bPlace: WiFi Shield | SKU: WIFI | freetronics | !WCS | WEN | !SDS | IRQ | www.freetronics.com/wifi | (C) 2014 Freetronics Pty Ltd / Licensed under TAPR / Open Hardware License / http://tapr.org/ohl